# EAGLE design bandpass 40m v4 (EAGLE 9.1.2)
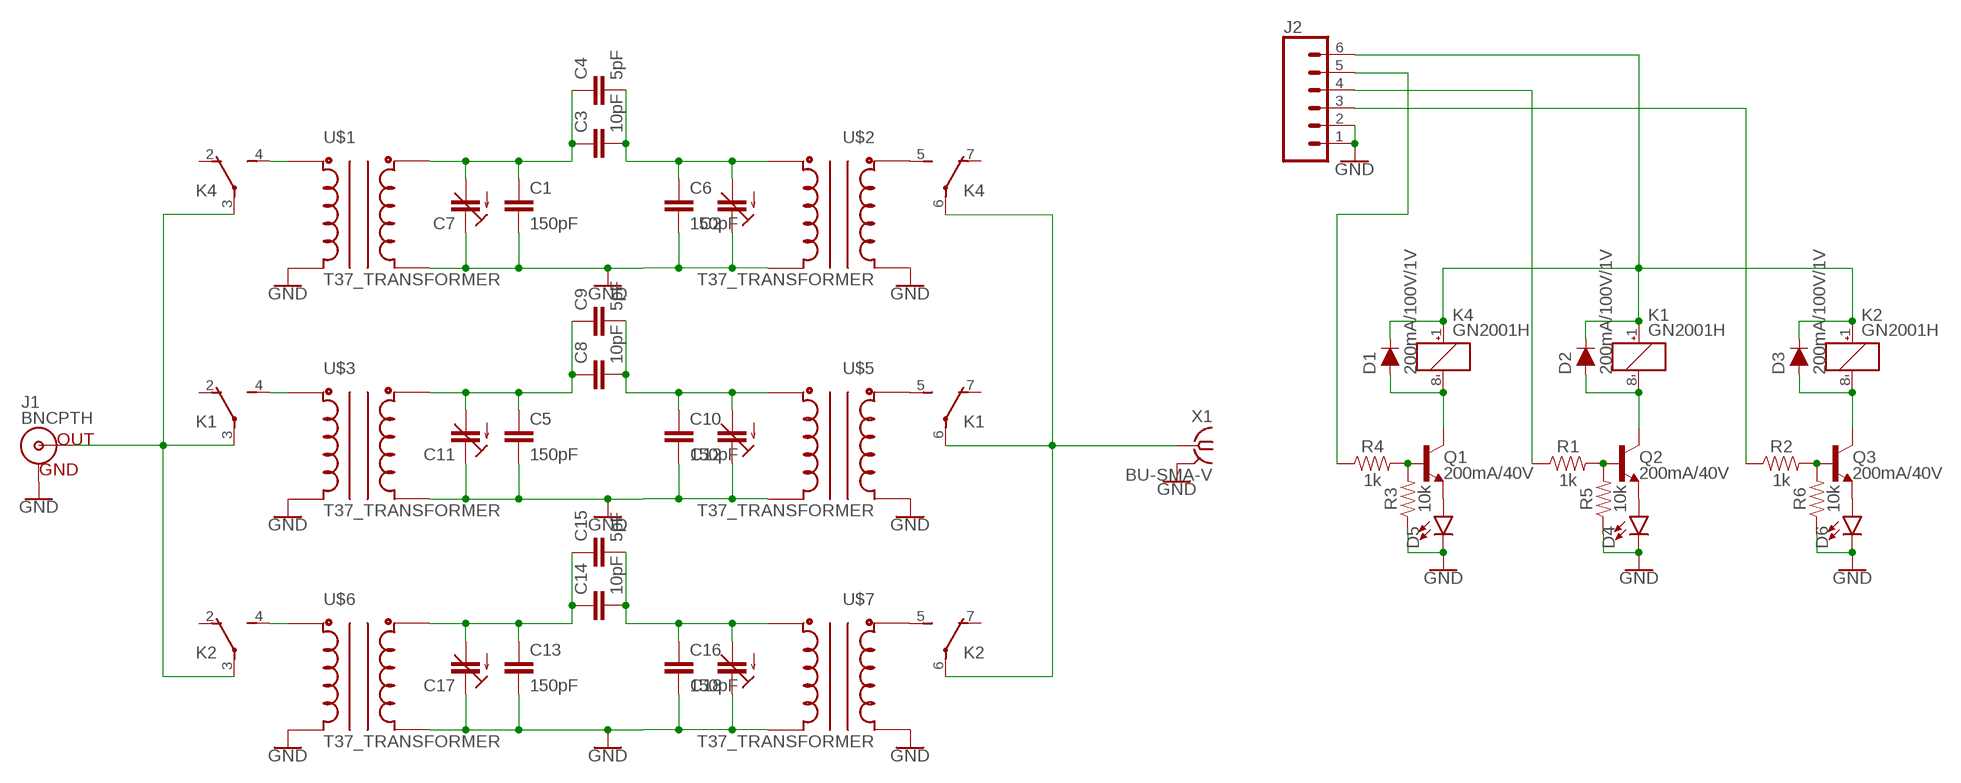
[diagram p0: schematic, sheet 1]

## Parts
C1  150pF  C5/3.5  [C5B3.5]
C2  C-TRIMMTZ03  [CTRIMTZ03]
C3  10pF  C5/3.5  [C5B3.5]
C4  5pF  C5/3.5  [C5B3.5]
C5  150pF  C5/3.5  [C5B3.5]
C6  150pF  C5/3.5  [C5B3.5]
C7  C-TRIMMTZ03  [CTRIMTZ03]
C8  10pF  C5/3.5  [C5B3.5]
C9  5pF  C5/3.5  [C5B3.5]
C10  150pF  C5/3.5  [C5B3.5]
C11  C-TRIMMTZ03  [CTRIMTZ03]
C12  C-TRIMMTZ03  [CTRIMTZ03]
C13  150pF  C5/3.5  [C5B3.5]
C14  10pF  C5/3.5  [C5B3.5]
C15  5pF  C5/3.5  [C5B3.5]
C16  150pF  C5/3.5  [C5B3.5]
C17  C-TRIMMTZ03  [CTRIMTZ03]
C18  C-TRIMMTZ03  [CTRIMTZ03]
D1  200mA/100V/1V  DIODE-1N4148  [DIODE-1N4148]
D2  200mA/100V/1V  DIODE-1N4148  [DIODE-1N4148]
D3  200mA/100V/1V  DIODE-1N4148  [DIODE-1N4148]
D4  LED5MM  [LED_5MM]
D5  LED5MM  [LED_5MM]
D6  LED5MM  [LED_5MM]
J1  BNCPTH  [BNC]
J2  CONN_06LONGPADS  [1X06_LONGPADS]
K1  GN2001H  [GN]
K2  GN2001H  [GN]
K4  GN2001H  [GN]
Q1  200mA/40V  TRANS_NPN-2N3904  [TO-92]
Q2  200mA/40V  TRANS_NPN-2N3904  [TO-92]
Q3  200mA/40V  TRANS_NPN-2N3904  [TO-92]
R1  1k  1KOHM-HORIZ-1/4W-1%  [AXIAL-0.3]
R2  1k  1KOHM-HORIZ-1/4W-1%  [AXIAL-0.3]
R3  10k  1KOHM-HORIZ-1/4W-1%  [AXIAL-0.3]
R4  1k  1KOHM-HORIZ-1/4W-1%  [AXIAL-0.3]
R5  10k  1KOHM-HORIZ-1/4W-1%  [AXIAL-0.3]
R6  10k  1KOHM-HORIZ-1/4W-1%  [AXIAL-0.3]
U$1  T37_TRANSFORMER  [T37_TRANSFORMER]
U$2  T37_TRANSFORMER  [T37_TRANSFORMER]
U$3  T37_TRANSFORMER  [T37_TRANSFORMER]
U$5  T37_TRANSFORMER  [T37_TRANSFORMER]
U$6  T37_TRANSFORMER  [T37_TRANSFORMER]
U$7  T37_TRANSFORMER  [T37_TRANSFORMER]
X1  BU-SMA-V  [BU-SMA-V]

## Nets
GND: C1.2 C2.1(E) C5.2 C6.2 C7.1(E) C10.2 C11.1(E) C12.1(E) C13.2 C16.2 C17.1(E) C18.1(E) D4.K(C) D5.K(C) D6.K(C) J1.GND J2.1 J2.2 R3.P$1 R5.P$1 R6.P$1 U$1.C1A U$1.C2A U$2.C1A U$2.C2A U$3.C1A U$3.C2A U$5.C1A U$5.C2A U$6.C1A U$6.C2A U$7.C1A U$7.C2A X1.2 X1.3 X1.4 X1.5
N$1: C1.1 C3.1 C4.1 C7.2(A) U$1.C2B
N$2: K4.4(S:S) U$1.C1B
N$3: C2.2(A) C3.2 C4.2 C6.1 U$2.C2B
N$4: K1.6(T:P) K2.6(T:P) K4.6(T:P) X1.1
N$5: K4.5(T:S) U$2.C1B
N$6: C5.1 C8.1 C9.1 C11.2(A) U$3.C2B
N$7: C8.2 C9.2 C10.1 C12.2(A) U$5.C2B
N$8: K1.4(S:S) U$3.C1B
N$9: K1.5(T:S) U$5.C1B
N$10: C13.1 C14.1 C15.1 C17.2(A) U$6.C2B
N$11: C14.2 C15.2 C16.1 C18.2(A) U$7.C2B
N$12: J1.S(OUT) K1.3(S:P) K2.3(S:P) K4.3(S:P)
N$13: K2.5(T:S) U$7.C1B
N$14: K2.4(S:S) U$6.C1B
N$15: D1.A K4.8(R:-) Q1.3(C)
N$16: D2.A K1.8(R:-) Q2.3(C)
N$17: D3.A K2.8(R:-) Q3.3(C)
N$18: D5.A Q1.1(E)
N$19: J2.5 R4.P$1
N$20: J2.4 R1.P$1
N$21: J2.3 R2.P$1
N$22: D1.C D2.C D3.C J2.6 K1.1(R:+) K2.1(R:+) K4.1(R:+)
N$23: D4.A Q2.1(E)
N$24: D6.A Q3.1(E)
N$25: Q1.2(B) R3.P$2 R4.P$2
N$26: Q2.2(B) R1.P$2 R5.P$2
N$27: Q3.2(B) R2.P$2 R6.P$2
Unconnected: K1.2(S:O) K1.7(T:O) K2.2(S:O) K2.7(T:O) K4.2(S:O) K4.7(T:O)

## Library data of the parts
C1 C3-C6 C8-C10 C13-C16 = capacitor-wima:C: CAPACITOR naming: grid - package width
C2 C7 C11 C12 C17 C18 = resistor:C-TRIMM: Trimm capacitor
D1-D3 = SparkFun-DiscreteSemi:DIODE: Diode These are standard reverse protection diodes and small signal diodes. SparkFun Products: SparkFun SparkPunk Sound Kit <https://www.sparkfun.com/products/11177> SparkFun ESP8266 Thing <https://www.sparkfun.com/products/13231>; PROD_ID: DIO-08378
D4-D6 = SparkFun-LED:LED: LED (Generic) Standard schematic elements and footprints for 5mm, 3mm, 1206, and 0603 sized LEDs. Generic LEDs with no color specified.
J1 = SparkFun-Connectors:BNC: BNC Right Angle Connector Mouser Part# 5227161 SparkFun Products: BNC Connector - Right Angle <https://www.sparkfun.com/products/10550>; PROD_ID: LPA-12729; SF_ID: PRT-10550
J2 = SparkFun-Connectors:CONN_06: Multi connection point. Often used as Generic Header-pin footprint for 0.1 inch spaced/style header connections On any of the 0.1 inch spaced packages, you can populate with these: Break Away Headers - Straight <https://www.sparkfun.com/products/116> (PRT-00116) Break Away Male Headers - Right Angle <https://www.sparkfun.com/products/553> (PRT-00553) Female Headers <https://www.sparkfun.com/products/115> (PRT-00115) Break Away Headers - Machine Pin <https://www.sparkfun.com/products/117> (PRT-00117) Break Away Female Headers - Swiss Machine Pin <https://www.sparkfun.com/products/743> (PRT-00743) Arduino Stackable Header - 6 Pin <https://www.sparkfun.com/products/9280> (PRT-09280) For SCREWTERMINALS and SPRING TERMINALS visit here: Screw Terimnals on SparkFun.com <https://www.sparkfun.com/search/results?term=Screw+Terminals> (5mm/3.5mm/2.54mm spacing) This device is also useful as a general connection point to wire up your design to another part of your project. Our various solder wires solder well into these plated through hole pads. Hook-Up Wire - Assortment (Stranded, 22 AWG) <https://www.sparkfun.com/products/11375> (PRT-11375) Hook-Up Wire - Assortment (Solid Core, 22 AWG) <https://www.sparkfun.com/products/11367> (PRT-11367) View the entire wire category on our website here <https://www.sparkfun.com/categories/141>
K1 K2 K4 = relay:GN?*: ULTRA-SMALL PACKAGE SLIM POLARIZED RELAY NAiS Source: http://www.mew-europe.com/.. en_ds_61007_0000.pdf
Q1-Q3 = SparkFun-DiscreteSemi:TRANS_NPN: NPN transistor Current controlled devices typically used to amplify current or used as a switch. BC547 - COM-08928 <http://www.sparkfun.com/products/8928> (TO-92 45V 100mA) (1.Collector 2.Base 3.Emitter) 2N3904 - COM-00521 <http://www.sparkfun.com/products/521> (TO-92 40V 200mA) (1.Emitter 2.Base 3.Collector) P2N2222A - COM-12852 <http://www.sparkfun.com/products/12852> (TO-92 40V 600mA) (1.Collector 2.Base 3.Emitter); PROD_ID: TRANS-08447
R1 R2 R4 = SparkFun-Resistors:1KOHM: 1kΩ resistor A resistor is a passive two-terminal electrical component that implements electrical resistance as a circuit element. Resistors act to reduce current flow, and, at the same time, act to lower voltage levels within circuits. - Wikipedia; PROD_ID: RES-12182
R3 R5 R6 = SparkFun-Resistors:1KOHM: 1kΩ resistor A resistor is a passive two-terminal electrical component that implements electrical resistance as a circuit element. Resistors act to reduce current flow, and, at the same time, act to lower voltage levels within circuits. - Wikipedia; PROD_ID: RES-12182; VALUE: 1k
U$1-U$3 U$5-U$7 = toroid:T37_TRANSFORMER: Transformer wound on a T37 Toroid
X1 = con-coax:BU-SMA-V: FEMALE SMA CONNECTOR Radiall distributor RS 112-3794; OC_FARNELL: unknown; OC_NEWARK: unknown

## Net classes
0 default: width 0.762 mm, drill 0.762 mm, clearance 0.508 mm

## Board
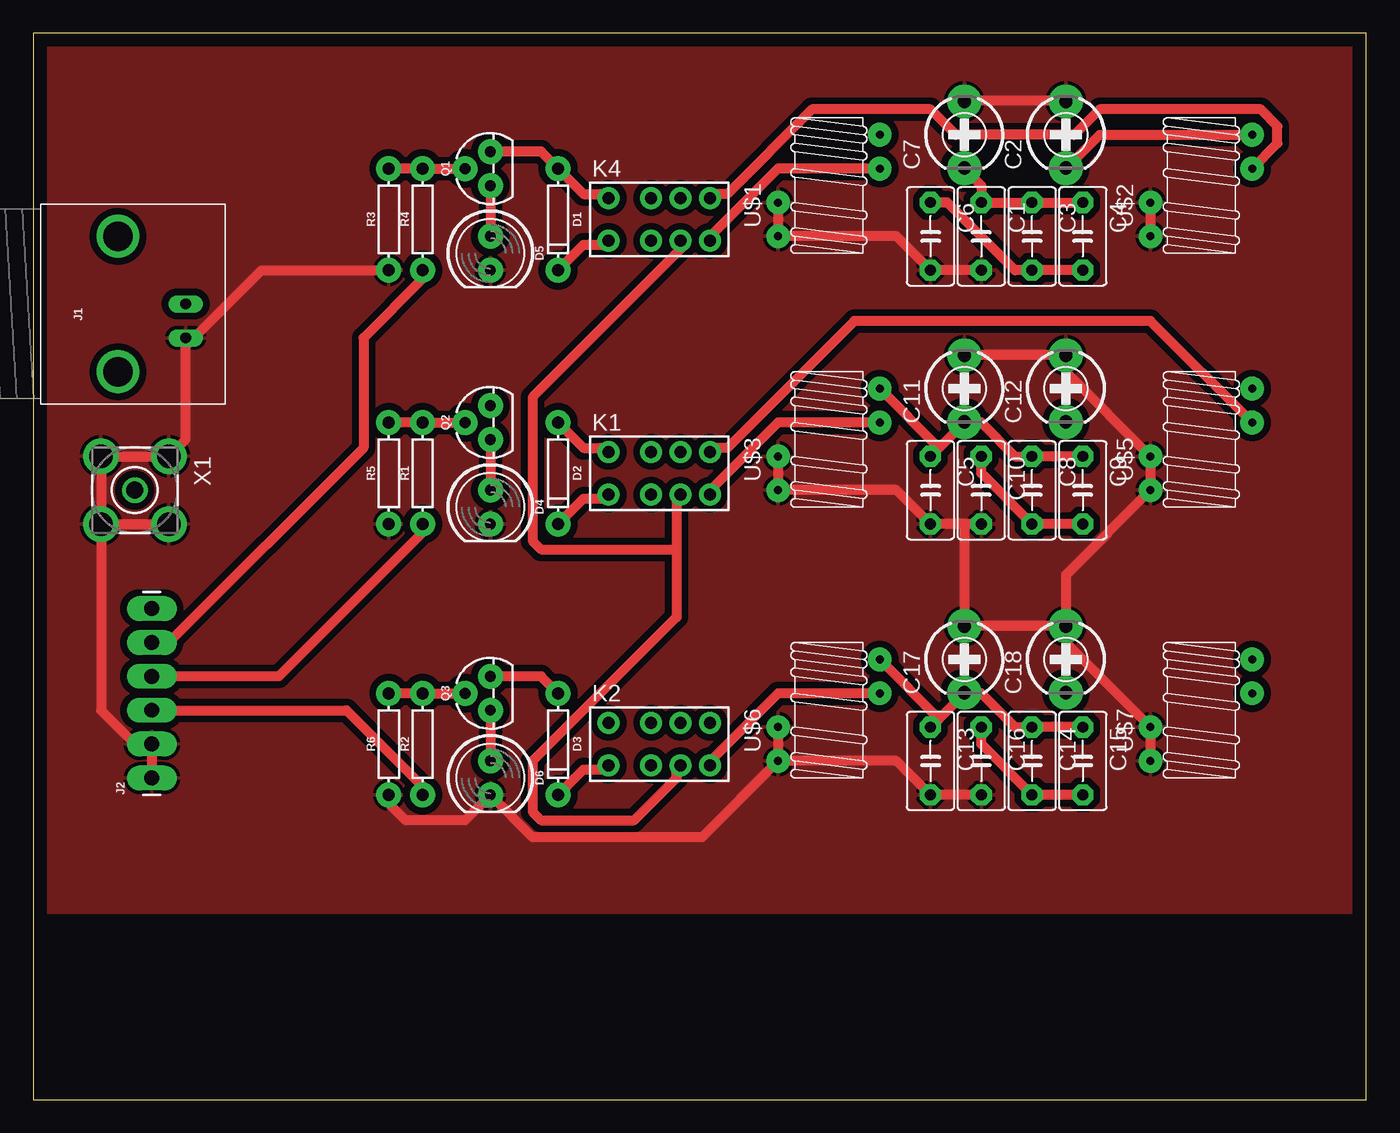
[diagram p1: board, top side]
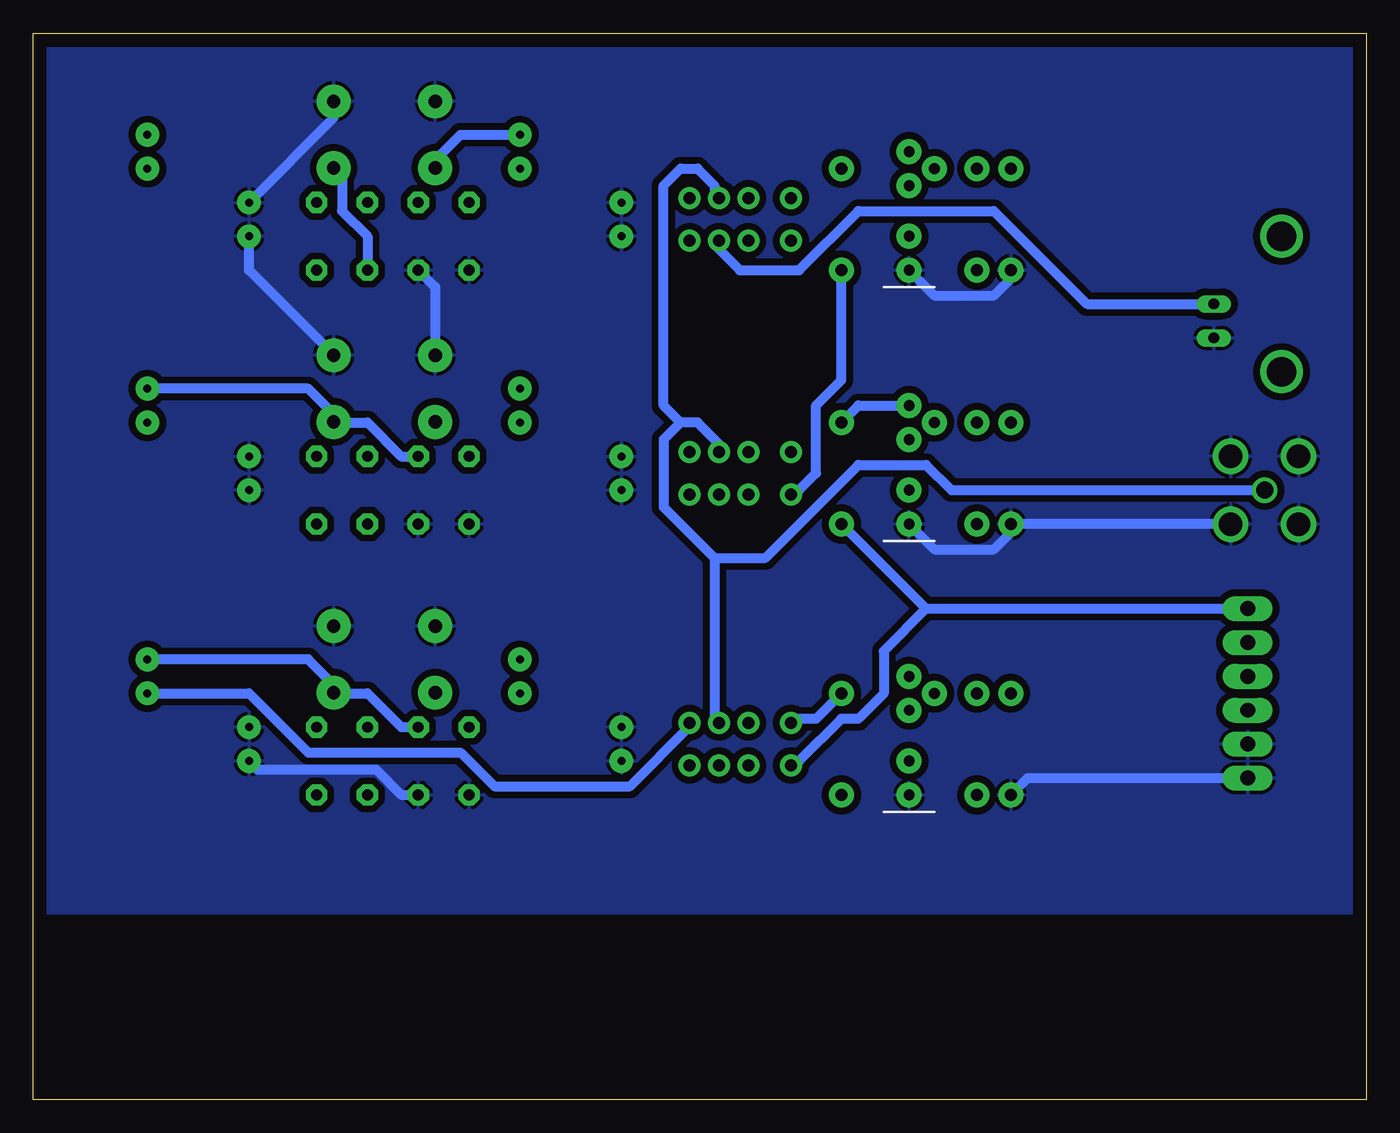
[diagram p2: board, bottom side, seen from below]

Size 100 x 80 mm. Coordinates in mm from the lower left corner, seen from the top.
Outline: 0,0 100,0 100,80 0,80 0,0
Copper layers (1*16): Top 0.035mm / dielectric 1.5mm / Bottom 0.035mm
Design rules "default": minimum track width 6mil, minimum drill 0.35mm, track to track 6mil, track to pad 6mil, pad to pad 6mil, via to via 6mil, smd to smd 6mil, copper to edge 40mil, drill to drill 6mil, minimum pad ring 10mil, minimum via ring 8mil, stop-mask expansion 4mil, vias tented up to drill 0mil, thermal gap 10mil

### Footprints (pad centres in the part's own frame; a part is rotated, then mirrored left to right if it is on the bottom)
C5B3.5 = drill 0.813 pad 1.6 octagon: 1 -2.54,0; 2 2.54,0
CTRIMTZ03 = drill 1 pad 2.54: 1 0,2.5; 2 0,-2.5
DIODE-1N4148 = drill 0.9 pad 1.88: A -3.81,0; C 3.81,0
LED_5MM = drill 0.813 pad 1.88: A -1.27,0; K 1.27,0
BNC = drill 2.2: 3 -5.08,5.08; 4 5.08,5.08 | drill 0.8 long: GND -2.54,0; S 0,0
1X06_LONGPADS = drill 1.118 pad 1.88 long: 1 0,0; 2 2.54,0; 3 5.08,0; 4 7.62,0; 5 10.16,0; 6 12.7,0
GN = drill 0.9 pad 1.651: 1 -3.835,-1.6; 2 -0.635,-1.6; 3 1.565,-1.6; 4 3.765,-1.6; 5 3.765,1.6; 6 1.565,1.6; 7 -0.635,1.6; 8 -3.835,1.6
TO-92 = drill 0.813 pad 1.88: 1 -1.27,0; 2 0,1.905; 3 1.27,0
AXIAL-0.3 = drill 0.9 pad 1.88: P$1 -3.81,0; P$2 3.81,0
T37_TRANSFORMER = drill 0.6 pad 1.778: C1A -3.81,-3.81; C1B 3.81,1.27; C2A -3.81,-1.27; C2B 3.81,3.81
BU-SMA-V = drill 1.27: 1 0,0 | drill 1.778: 2 -2.55,2.55; 3 2.55,2.55; 4 2.55,-2.55; 5 -2.55,-2.55

### Placement (x,y rotation side)
C1  71.12,64.77 270 top
C2  77.47,72.39 0 top
C3  74.93,64.77 270 top
C4  78.74,64.77 270 top
C5  67.31,45.72 270 top
C6  67.31,64.77 270 top
C7  69.85,72.39 0 top
C8  74.93,45.72 270 top
C9  78.74,45.72 270 top
C10  71.12,45.72 270 top
C11  69.85,53.34 0 top
C12  77.47,53.34 0 top
C13  67.31,25.4 270 top
C14  74.93,25.4 270 top
C15  78.74,25.4 270 top
C16  71.12,25.4 270 top
C17  69.85,33.02 0 top
C18  77.47,33.02 0 top
D1  39.37,66.04 270 top
D2  39.37,46.99 270 top
D3  39.37,26.67 270 top
D4  34.29,44.45 270 top
D5  34.29,63.5 270 top
D6  34.29,24.13 270 top
J1  11.43,59.69 90 top
J2  8.89,24.13 90 top
K1  46.99,46.99 0 top
K2  46.99,26.67 0 top
K4  46.99,66.04 0 top
Q1  34.29,69.85 90 top
Q2  34.29,50.8 90 top
Q3  34.29,30.48 90 top
R1  29.21,46.99 90 top
R2  29.21,26.67 90 top
R3  26.67,66.04 90 top
R4  29.21,66.04 90 top
R5  26.67,46.99 90 top
R6  26.67,26.67 90 top
U$1  59.69,68.58 0 top
U$2  87.63,68.58 0 top
U$3  59.69,49.53 0 top
U$5  87.63,49.53 0 top
U$6  59.69,29.21 0 top
U$7  87.63,29.21 0 top
X1  7.62,45.72 270 top

### Tracks (layer width: path | path; a pad name or v marks a point on that pad's centre or on a via)
GND
  Top 0.762: 11.43,56.52 11.43,49.53 10.79,48.9 X1.2 X1.5 | 11.43,56.52 J1.GND | R3.P$1 17.14,62.23 11.43,56.52 | J2.1 J2.2 7.62,26.67 5.08,29.21 5.08,42.55 X1.4 | R6.P$1 26.67,22.23 27.94,20.95 32.38,20.95 D6.K 37.47,19.68 50.16,19.68 U$6.C1A | X1.5 X1.4 | X1.5 | X1.4 X1.3 | U$6.C2A U$6.C1A | C16.2 C13.2 64.77,25.4 U$6.C1A | U$7.C1A U$7.C2A 77.47,34.29 77.47,34.92 C18.1 77.47,35.56 | U$3.C2A U$3.C1A 64.77,45.72 C5.2 69.85,43.18 | C10.2 69.85,43.18 | 69.85,43.18 69.85,35.56 | 69.85,35.56 C17.1 | 69.85,35.56 77.47,35.56 | U$2.C2A U$2.C1A | C7.1 69.85,74.93 77.47,74.93 C2.1 | U$1.C2A U$1.C1A 64.77,64.77 C6.2 C1.2 | C11.1 69.85,55.88 77.47,55.88 C12.1 77.47,55.24 77.47,54.61 U$5.C2A U$5.C1A 77.47,39.37 77.47,35.56
  Bottom 0.762: R3.P$1 26.67,61.59 27.94,60.33 32.38,60.33 D5.K | J2.1 25.4,24.13 R6.P$1 | D4.K 32.38,41.27 27.94,41.27 26.67,42.55 R5.P$1 10.79,43.18 X1.3 | C16.2 72.39,22.86 74.3,24.77 83.19,24.77 U$7.C1A | U$2.C2A 77.47,73.66 77.47,74.3 C2.1 | C1.2 69.85,60.96 69.85,55.88 C11.1 | U$2.C1A 83.82,62.23 77.47,55.88 C12.1
  pour Top: 0,80.01 100.33,80.01 100.33,13.97 0,13.97
  pour Bottom: 0,80.01 100.33,80.01 100.33,13.97 0,13.97
N$1
  Top 0.762: C7.2 69.85,69.85 71.12,68.58 C1.1 C3.1 C4.1
  Bottom 0.762: U$1.C2B 67.94,72.39 69.85,70.48 C7.2
N$2
  Top 0.762: U$1.C1B 55.88,69.85 50.8,64.77 K4.4
N$3
  Top 0.762: C4.2 C3.2 73.66,62.23 68.58,67.31 C6.1 | U$2.C2B 80.01,72.39 77.47,69.85 C2.2
  Bottom 0.762: C3.2 74.93,64.77 76.83,66.67 76.83,69.22 77.47,69.85 C2.2
N$4
  Bottom 0.762: 48.9,40.64 48.9,28.57 K2.6 | 48.9,40.64 52.7,44.45 52.7,49.53 51.44,50.8 | 51.44,50.8 50.16,50.8 48.26,48.9 K1.6 | 51.44,50.8 52.7,52.07 52.7,68.58 51.44,69.85 50.16,69.85 48.9,68.58 48.9,67.94 K4.6 | X1.1 31.11,45.72 33.02,47.62 38.1,47.62 45.09,40.64 48.9,40.64
N$5
  Top 0.762: U$2.C1B 93.34,71.75 93.34,73.03 92.08,74.3 80.01,74.3 78.11,72.39 69.22,72.39 67.31,74.3 58.42,74.3 52.07,67.94 50.8,67.94 K4.5
N$6
  Top 0.762: C9.1 C8.1 73.66,48.26 71.12,50.8 69.85,50.8 | 69.85,50.8 67.94,48.9 | 67.94,48.9 C5.1 | 69.85,50.8 C11.2 | 67.94,48.9 U$3.C2B
N$7
  Top 0.762: C9.2 C8.2 71.12,46.99 C10.1
  Bottom 0.762: U$5.C2B 79.38,53.34 77.47,51.44 C12.2 77.47,50.8 74.93,50.8 72.39,48.26 C10.1
N$8
  Top 0.762: U$3.C1B 55.88,50.8 50.8,45.72 K1.4
N$9
  Top 0.762: U$5.C1B 83.82,58.42 61.59,58.42 52.07,48.9 50.8,48.9 K1.5
N$10
  Top 0.762: C15.1 C14.1 73.66,27.94 71.12,30.48 69.85,30.48 | 69.85,30.48 67.94,28.57 | 67.94,28.57 C13.1 | 69.85,30.48 C17.2 | 67.94,28.57 U$6.C2B
N$11
  Top 0.762: C15.2 C14.2 71.12,26.67 C16.1
  Bottom 0.762: U$7.C2B 79.38,33.02 77.47,31.11 C18.2 77.47,30.48 74.93,30.48 72.39,27.94 C16.1
N$12
  Top 0.762: 48.26,41.27 48.26,45.09 K1.3 | 48.26,41.27 48.26,36.2 37.47,25.4 37.47,21.59 38.1,20.95 45.09,20.95 48.26,24.13 48.26,24.77 K2.3 | 48.26,41.27 38.1,41.27 37.47,41.91 37.47,52.7 48.9,64.14 K4.3
  Bottom 0.762: J1.S 20.95,59.69 27.94,66.67 38.1,66.67 42.55,62.23 46.99,62.23 48.9,64.14 K4.3
N$13
  Bottom 0.762: U$7.C1B 83.82,30.48 79.38,26.04 67.94,26.04 65.41,23.5 55.24,23.5 50.8,27.94 K2.5
N$14
  Top 0.762: U$6.C1B 55.88,30.48 50.8,25.4 K2.4
N$15
  Top 0.762: K4.8 42.55,67.94 41.27,67.94 D1.A 38.1,71.12 Q1.3
N$16
  Top 0.762: D2.A 41.27,48.9 42.55,48.9 K1.8
  Bottom 0.762: Q2.3 38.1,52.07 D2.A
N$17
  Top 0.762: Q3.3 38.1,31.75 D3.A
  Bottom 0.762: D3.A 41.27,28.57 42.55,28.57 K2.8
N$18
  Top 0.762: Q1.1 D5.A
N$19
  Top 0.762: J2.5 10.16,34.29 24.77,48.9 24.77,57.15 29.21,61.59 R4.P$1
N$20
  Top 0.762: J2.4 18.41,31.75 29.21,42.55 R1.P$1
N$21
  Top 0.762: R2.P$1 29.21,23.5 23.5,29.21 J2.3
N$22
  Top 0.762: D1.C 41.27,64.14 42.55,64.14 K4.1 | D3.C 41.27,24.77 42.55,24.77 K2.1 | D2.C 41.27,45.09 42.55,45.09 K1.1
  Bottom 0.762: 33.02,36.83 J2.6 | D2.C 33.02,36.83 | 33.02,36.83 36.2,33.66 36.2,30.48 38.1,28.57 39.37,28.57 42.55,25.4 K2.1 | D1.C 39.37,53.98 41.27,52.07 41.27,46.99 42.55,45.72 K1.1
N$23
  Top 0.762: Q2.1 D4.A
N$24
  Top 0.762: Q3.1 D6.A
N$25
  Top 0.762: R3.P$2 R4.P$2 Q1.2
N$26
  Top 0.762: R5.P$2 R1.P$2 Q2.2
N$27
  Top 0.762: R6.P$2 R2.P$2 Q3.2